# Altium project PCB_Project.PrjPcb
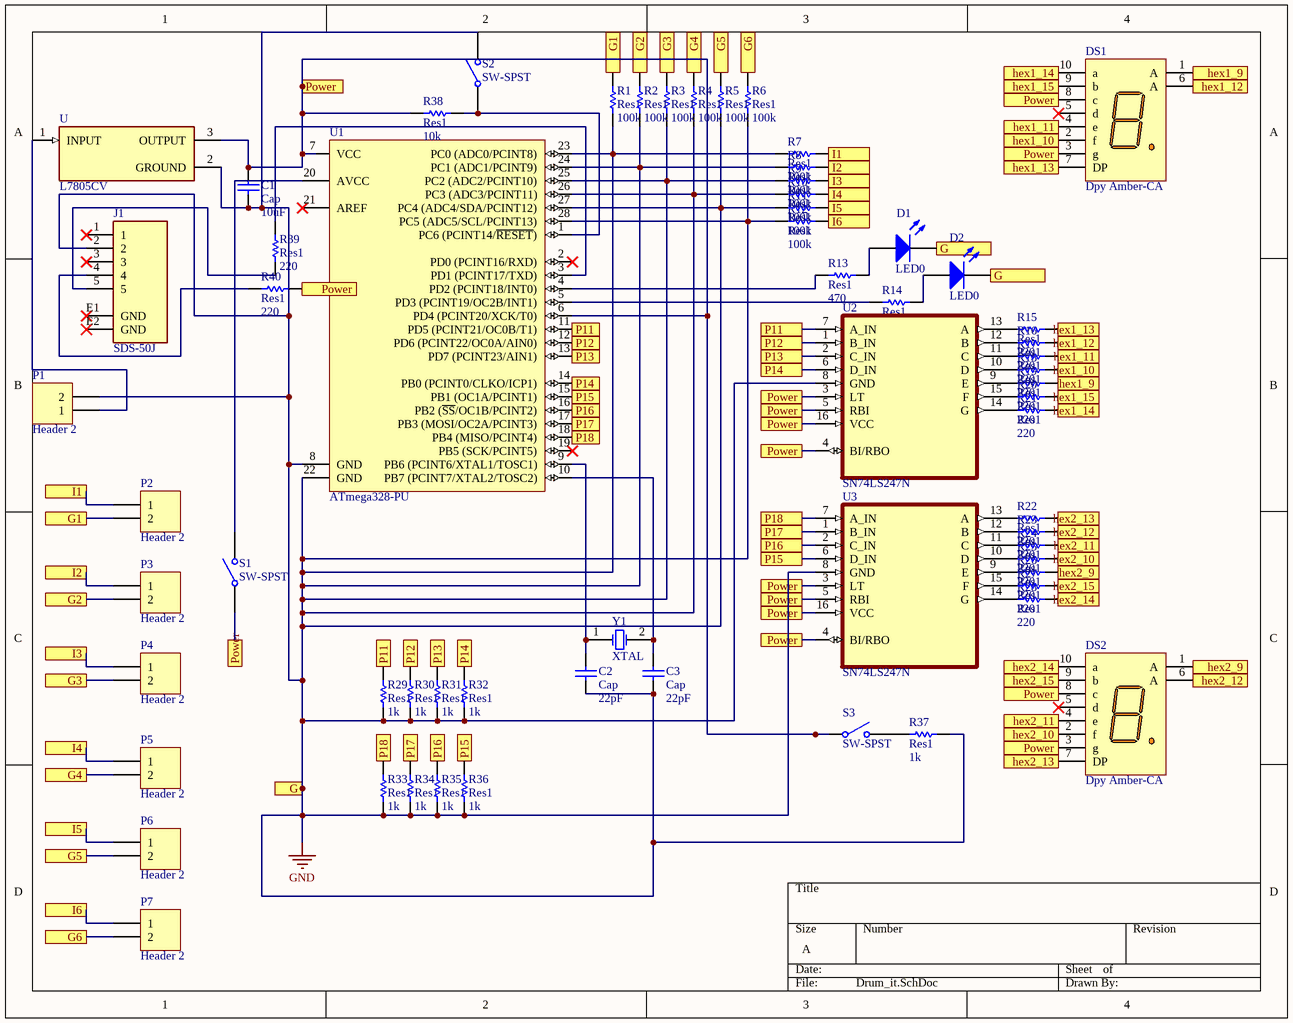
[diagram p0: Drum_it.SchDoc]
1 sheet, 63 parts. Net scope: flat (ports and power ports of the same name join across sheets).
Board file: DRUM_IT.PcbDoc

## Sheet Drum_it.SchDoc
size A; SheetNumber: 1; SheetTotal: 1

### Parts
C1  Cap  value 10uF  [RAD-0.3]
C2  Cap  value 22pF  [RAD-0.3]
C3  Cap  value 22pF  [RAD-0.3]
D1  LED0  [LED-0]
D2  LED0  [LED-0]
DS1  Dpy Amber-CA  [A]
DS2  Dpy Amber-CA  [A]
J1  SDS-50J  [CUI_SDS-50J]
P1  Header 2  [HDR1X2]
P2  Header 2  [HDR1X2]
P3  Header 2  [HDR1X2]
P4  Header 2  [HDR1X2]
P5  Header 2  [HDR1X2]
P6  Header 2  [HDR1X2]
P7  Header 2  [HDR1X2]
R1  Res1  value 100k  [AXIAL-0.3]
R2  Res1  value 100k  [AXIAL-0.3]
R3  Res1  value 100k  [AXIAL-0.3]
R4  Res1  value 100k  [AXIAL-0.3]
R5  Res1  value 100k  [AXIAL-0.3]
R6  Res1  value 100k  [AXIAL-0.3]
R7  Res1  value 100k  [AXIAL-0.3]
R8  Res1  value 100k  [AXIAL-0.3]
R9  Res1  value 100k  [AXIAL-0.3]
R10  Res1  value 100k  [AXIAL-0.3]
R11  Res1  value 100k  [AXIAL-0.3]
R12  Res1  value 100k  [AXIAL-0.3]
R13  Res1  value 470  [AXIAL-0.3]
R14  Res1  value 470  [AXIAL-0.3]
R15  Res1  value 220  [AXIAL-0.3]
R16  Res1  value 220  [AXIAL-0.3]
R17  Res1  value 220  [AXIAL-0.3]
R18  Res1  value 220  [AXIAL-0.3]
R19  Res1  value 220  [AXIAL-0.3]
R20  Res1  value 220  [AXIAL-0.3]
R21  Res1  value 220  [AXIAL-0.3]
R22  Res1  value 220  [AXIAL-0.3]
R23  Res1  value 220  [AXIAL-0.3]
R24  Res1  value 220  [AXIAL-0.3]
R25  Res1  value 220  [AXIAL-0.3]
R26  Res1  value 220  [AXIAL-0.3]
R27  Res1  value 220  [AXIAL-0.3]
R28  Res1  value 220  [AXIAL-0.3]
R29  Res1  value 1k  [AXIAL-0.3]
R30  Res1  value 1k  [AXIAL-0.3]
R31  Res1  value 1k  [AXIAL-0.3]
R32  Res1  value 1k  [AXIAL-0.3]
R33  Res1  value 1k  [AXIAL-0.3]
R34  Res1  value 1k  [AXIAL-0.3]
R35  Res1  value 1k  [AXIAL-0.3]
R36  Res1  value 1k  [AXIAL-0.3]
R37  Res1  value 1k  [AXIAL-0.3]
R38  Res1  value 10k  [AXIAL-0.3]
R39  Res1  value 220  [AXIAL-0.3]
R40  Res1  value 220  [AXIAL-0.3]
S1  SW-SPST  [SPST-2]
S2  SW-SPST  [SPST-2]
S3  SW-SPST  [SPST-2]
U  L7805CV  [TO255P1040X460X1968-3]
U1  ATmega328-PU  [28P3]
U2  SN74LS247N  [DIP794W45P254L1969H508Q16]
U3  SN74LS247N  [DIP794W45P254L1969H508Q16]
Y1  XTAL  [R38]

### Ports
G, G1, G2, G3, G4, G5, G6, hex1_9, hex1_10, hex1_11, hex1_12, hex1_13, hex1_14, hex1_15, hex2_9, hex2_10, hex2_11, hex2_12, hex2_13, hex2_14, hex2_15, I1, I2, I3, I4, I5, I6, P11, P12, P13, P14, P15, P16, P17, P18, Power

### Nets
GND: C1.1 C2.1 C3.2 D1.2(K) D2.2(K) J1.2 P1.2 R1.1 R2.1 R3.1 R4.1 R5.1 R6.1 R7.1 R8.1 R9.1 R10.1 R11.1 R12.1 R29.1 R30.1 R31.1 R32.1 R33.1 R34.1 R35.1 R36.1 R37.1 S2.2(NO) U.2(GROUND) U1.8(GND) U1.22(GND) U1.23(PC0_(ADC0/PCINT8)) U1.24(PC1_(ADC1/PCINT9)) U1.25(PC2_(ADC2/PCINT10)) U1.26(PC3_(ADC3/PCINT11)) U1.27(PC4_(ADC4/SDA/PCINT12)) U1.28(PC5_(ADC5/SCL/PCINT13)) U2.8(GND) U3.8(GND) ; port G
NetC1_2: C1.2 DS1.3(g) DS1.8(c) DS2.3(g) DS2.8(c) R38.2 R40.1 S1.1(COMMON) S3.1(COMMON) U.3(OUTPUT) U1.6(PD4_(PCINT20/XCK/T0)) U1.7(VCC) U2.3(LT) U2.4(BI/RBO) U2.5(RBI) U2.16(VCC) U3.3(LT) U3.4(BI/RBO) U3.5(RBI) U3.16(VCC) ; port Power
NetC2_2: C2.2 U1.9(PB6_(PCINT6/XTAL1/TOSC1)) Y1.1(OSC1)
NetC3_1: C3.1 U1.10(PB7_(PCINT7/XTAL2/TOSC2)) Y1.2(OSC2)
NetD1_1: D1.1(A) R13.1
NetD2_1: D2.1(A) R14.1
NetDS1_1: DS1.1(A) R19.2 ; port hex1_9
NetDS1_2: DS1.2(f) R18.2 ; port hex1_10
NetDS1_4: DS1.4(e) R17.2 ; port hex1_11
NetDS1_6: DS1.6(A) R16.2 ; port hex1_12
NetDS1_7: DS1.7(DP) R15.2 ; port hex1_13
NetDS1_9: DS1.9(b) R20.2 ; port hex1_15
NetDS1_10: DS1.10(a) R21.2 ; port hex1_14
NetDS2_1: DS2.1(A) R26.2 ; port hex2_9
NetDS2_2: DS2.2(f) R25.2 ; port hex2_10
NetDS2_4: DS2.4(e) R24.2 ; port hex2_11
NetDS2_6: DS2.6(A) R23.2 ; port hex2_12
NetDS2_7: DS2.7(DP) R22.2 ; port hex2_13
NetDS2_9: DS2.9(b) R27.2 ; port hex2_15
NetDS2_10: DS2.10(a) R28.2 ; port hex2_14
NetJ1_4: J1.4 R40.2
NetJ1_5: J1.5 R39.1
NetP1_1: P1.1 U.1(INPUT)
NetP2_1: P2.1 R7.2 ; port I1
NetP2_2: P2.2 R1.2 ; port G1
NetP3_1: P3.1 R8.2 ; port I2
NetP3_2: P3.2 R2.2 ; port G2
NetP4_1: P4.1 R9.2 ; port I3
NetP4_2: P4.2 R3.2 ; port G3
NetP5_1: P5.1 R10.2 ; port I4
NetP5_2: P5.2 R4.2 ; port G4
NetP6_1: P6.1 R11.2 ; port I5
NetP6_2: P6.2 R5.2 ; port G5
NetP7_1: P7.1 R12.2 ; port I6
NetP7_2: P7.2 R6.2 ; port G6
NetR13_2: R13.2 U1.4(PD2_(PCINT18/INT0))
NetR14_2: R14.2 U1.5(PD3_(PCINT19/OC2B/INT1))
NetR15_1: R15.1 U2.13(A)
NetR16_1: R16.1 U2.12(B)
NetR17_1: R17.1 U2.11(C)
NetR18_1: R18.1 U2.10(D)
NetR19_1: R19.1 U2.9(E)
NetR20_1: R20.1 U2.15(F)
NetR21_1: R21.1 U2.14(G)
NetR22_1: R22.1 U3.13(A)
NetR23_1: R23.1 U3.12(B)
NetR24_1: R24.1 U3.11(C)
NetR25_1: R25.1 U3.10(D)
NetR26_1: R26.1 U3.9(E)
NetR27_1: R27.1 U3.15(F)
NetR28_1: R28.1 U3.14(G)
NetR29_2: R29.2 U1.11(PD5_(PCINT21/OC0B/T1)) U2.7(A_IN) ; port P11
NetR30_2: R30.2 U1.12(PD6_(PCINT22/OC0A/AIN0)) U2.1(B_IN) ; port P12
NetR31_2: R31.2 U1.13(PD7_(PCINT23/AIN1)) U2.2(C_IN) ; port P13
NetR32_2: R32.2 U1.14(PB0_(PCINT0/CLKO/ICP1)) U2.6(D_IN) ; port P14
NetR33_2: R33.2 U1.18(PB4_(MISO/PCINT4)) U3.7(A_IN) ; port P18
NetR34_2: R34.2 U1.17(PB3_(MOSI/OC2A/PCINT3)) U3.1(B_IN) ; port P17
NetR35_2: R35.2 U1.16(PB2_(~{SS}/OC1B/PCINT2)) U3.2(C_IN) ; port P16
NetR36_2: R36.2 U1.15(PB1_(OC1A/PCINT1)) U3.6(D_IN) ; port P15
NetR37_2: R37.2 S3.2(NO)
NetR38_1: R38.1 S2.1(COMMON) U1.1(PC6_(PCINT14/~{RESET}))
NetR39_2: R39.2 U1.3(PD1_(PCINT17/TXD))
NetS1_2: S1.2(NO) U1.20(AVCC)

Not connected (* = marked no-connect by the designer): DS1 5(d)*; DS2 5(d)*; J1 1* 3* E1(GND)* E2(GND)*; U1 2(PD0_(PCINT16/RXD))* 19(PB5_(SCK/PCINT5))* 21(AREF)*

### Library data of the parts
C1-C3 = Cap: Capacitor; Published: 8-Jun-2000; LatestRevisionDate: 17-Jul-2002; LatestRevisionNote: Re-released for DXP Platform.; PackageReference: RAD-0.3; Publisher: Altium Limited; PackageDescription: Radial Cap, Thru-Hole; 2 Leads; 0.3 in Pin Spacing
D1 D2 = LED0: Typical INFRARED GaAs LED; Published: 8-Jun-2000; LatestRevisionDate: 08-Jul-2005; LatestRevisionNote: Mech Layer 1 removed.; PackageReference: LED-0; Publisher: Altium Limited; PackageDescription: LED; 2 Leads
DS1 DS2 = Dpy Amber-CA: 7.62 mm Black Surface Orange 7-Segment Display: CA, RH DP; MinimumIntensity: 354 ucd; Note: IF = 5 mA; Note: Pins 1 and 6 are redundant Anodes.; Published: 8-Jun-2000; LatestRevisionDate: 17-Dec-2003; LatestRevisionNote: Schematic revised, PCB Footprint replaced.; DatasheetVersion: 19-Feb-2002; PackageVersion: 11-Feb-2002; PackageReference: A; Publisher: Altium Limited; PackageDescription: LED, 7-Segment Display, 7.62 mm, RHD; 10 Leads; Row Space 5.08 mm; Pitch 2.54 mm; Colour: Orange; ComponentLink1Description: Manufacturer Link; ComponentLink1URL: http://www.agilent.com/
P1-P7 = Header 2: Header, 2-Pin; LatestRevisionDate: 17-Jul-2002; LatestRevisionNote: Re-released for DXP Platform.; Publisher: Altium Limited
R1-R40 = Res1: Resistor; Published: 8-Jun-2000; LatestRevisionDate: 17-Jul-2002; LatestRevisionNote: Re-released for DXP Platform.; PackageReference: AXIAL-0.3; Publisher: Altium Limited; PackageDescription: Axial Device, Thru-Hole; 2 Leads; 0.3 in Pin Spacing
S1-S3 = SW-SPST: Single-Pole, Single-Throw Switch; Published: 24-Mar-1999; LatestRevisionDate: 17-Jul-2002; LatestRevisionNote: Re-released for DXP Platform.; PackageReference: SPST-2; Publisher: Altium Limited; PackageDescription: Switch; 2 Leads
U = L7805CV: Linear Voltage Regulator IC 1 Output 1.5A TO-220AB; MF: STMicroelectronics; Price: None; Package: TO-220 STMicroelectronics; Value: *; MP: L7805CV; Availability: Unavailable; SnapEDA_Link: https://www.snapeda.com/parts/L7805CV/STMicroelectronics/view-part/501150/?ref=snap
U1 = CMP-0095-00015-2: 8-bit AVR Microcontroller, 32KB Flash, 1KB EEPROM, 2KB SRAM, 28-pin PDIP, Industrial Grade (-40°C to 85°C); ComponentLink3Description: ATmega48A/48PA/88A/88PA/168A/168PA/328/328P Summary; RevisionNote: DatasheetVersion updated. URLs added.; DatasheetVersion: revD, May-2011; ComponentLink1URL: http://www.atmel.com/; PackageVersion: revB, Sep-2001; PackageDescription: 28-lead (0.300"/7.62mm Wide) Plastic Dual Inline Package (PDIP); PackageReference: 28P3; ComponentLink1Description: Manufacturer URL; ComponentLink2Description: ATmega48A/48PA/88A/88PA/168A/168PA/328/328P Datasheet; ComponentLink3URL: http://www.atmel.com/dyn/resources/prod_documents/8271S.pdf; ComponentLink2URL: http://www.atmel.com/dyn/resources/prod_documents/8271.pdf
U2 U3 = SN74LS247N: BCD-To-Seven-Segment Decoders/Drivers 16-PDIP 0 to 70; MF: Texas Instruments; Value: *; Check_prices: https://www.snapeda.com/parts/SN74LS247N/Texas%20Instruments/view-part/230215/?ref=eda; Package: PDIP-16 Texas Instruments; Digi-Key_Part_Number: 296-28943-2-ND; SnapEDA_Link: https://www.snapeda.com/parts/SN74LS247N/Texas%20Instruments/view-part/230215/?ref=snap; Purchase-URL: https://pricing.snapeda.com/search/part/SN74LS247N/?ref=eda; MP: SN74LS247N
Y1 = XTAL: Crystal Oscillator; Published: 8-Jun-2000; LatestRevisionDate: 17-Jul-2002; LatestRevisionNote: Re-released for DXP Platform.; PackageReference: R38; Publisher: Altium Limited; PackageDescription: Crystal, Thru-Hole; 2 Leads; Body 3.1 x 8.2 mm (Dia.xH)
J1 = SDS-50J: Value: *; MP: SDS-50J; Package: None; Availability: Unavailable; Price: None